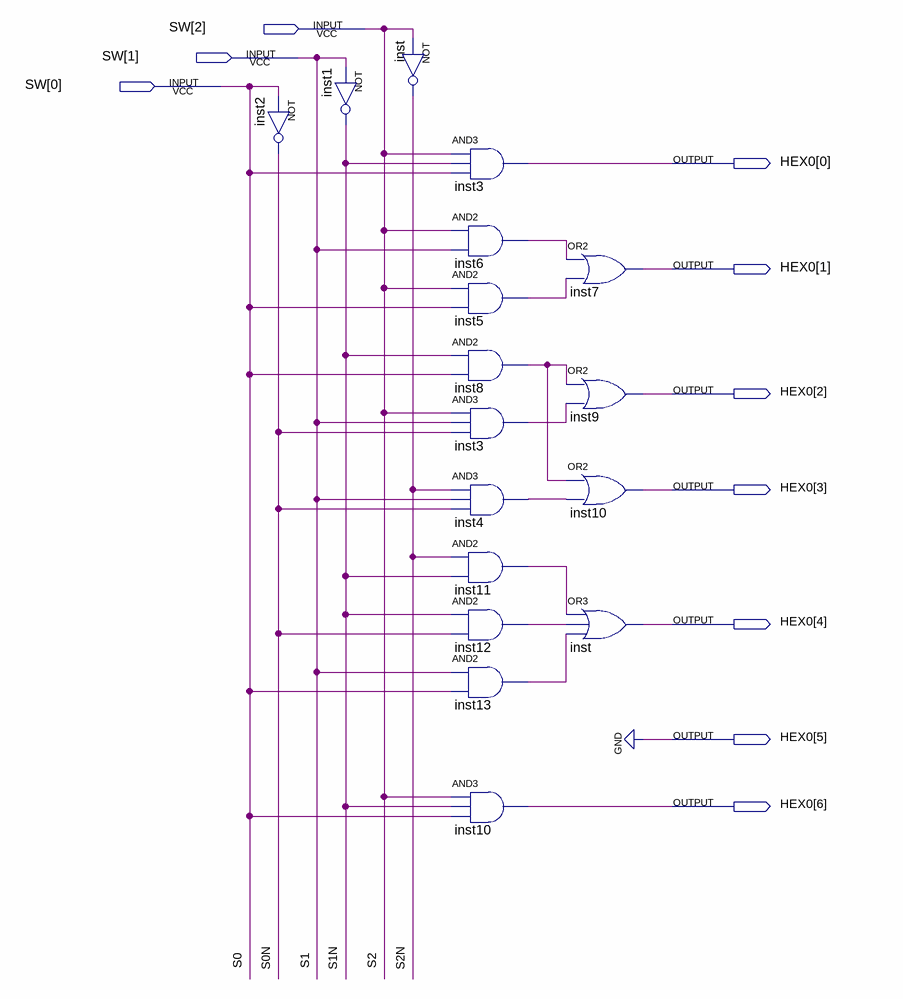
[diagram p0: schematic sheet]
// Quartus schematic sop.bdf as structural Verilog: 17 symbols, 10 pins
module sop (
  input  [2:0] SW,
  output [6:0] HEX0
);

  wire inst3_out, inst4_out, inst5_out, inst6_out, inst8_out, inst11_out, inst12_out, inst13_out, S0N, S1N,
       S2N;

  not inst1 (S1N, SW[1]);
  not inst2 (S0N, SW[0]);
  not inst (S2N, SW[2]);
  and inst3 (HEX0[0], SW[2], S1N, SW[0]);
  and inst6 (inst6_out, SW[2], SW[1]);
  and inst5 (inst5_out, SW[2], SW[0]);
  and inst8 (inst8_out, S1N, SW[0]);
  and inst3_dup2 (inst3_out, SW[2], SW[1], S0N);
  and inst4 (inst4_out, S2N, SW[1], S0N);
  and inst11 (inst11_out, S2N, S1N);
  and inst12 (inst12_out, S1N, S0N);
  and inst13 (inst13_out, SW[1], SW[0]);
  and inst10 (HEX0[6], SW[2], S1N, SW[0]);
  or inst7 (HEX0[1], inst6_out, inst5_out);
  or inst9 (HEX0[2], inst8_out, inst3_out);
  or inst10_dup2 (HEX0[3], inst8_out, inst4_out);
  or inst_dup2 (HEX0[4], inst11_out, inst12_out, inst13_out);

  assign HEX0[5] = 1'b0;

  // Other names for the same wires on the sheet: S0 = SW[0]; S1 = SW[1]; S2 = SW[2]
endmodule
